# Altium schematic sheet SENSORS.SchDoc
size A4
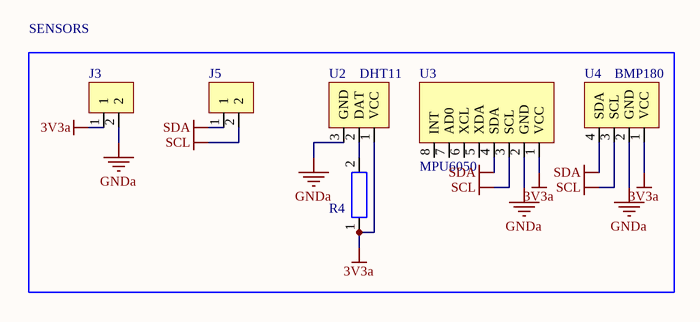
[diagram p0: SENSORS.SchDoc]

## Parts
J3  2x1_CONN  [CONN2x1_2.54mm]  (value not drawn)
J5  2x1_CONN  [CONN2x1_2.54mm]  (value not drawn)
R4  330R  [THT RESISTOR]  (value not drawn)
U2  DHT11  [DHT11]
U3  MPU6050  [MPU6050]
U4  BMP180  [BMP180]

## Blocks framed on the sheet
SENSORS: J3 J5 R4 U2-U4

## Nets
3V3a: J3.1 R4.1 U2.1(VCC) U3.1(VCC) U4.1(VCC)
GNDa: J3.2 U2.3(GND) U3.2(GND) U4.2(GND)
SCL: J5.2 U3.3(SCL) U4.3(SCL)
SDA: J5.1 U3.4(SDA) U4.4(SDA)
NetR4_2: R4.2 U2.2(DAT)

Not connected (* = marked no-connect by the designer): U3 5(XDA) 6(XCL) 7(AD0) 8(INT)

## Library data of the parts
J3 J5 = CONN 2x1: THT 2x1 2.54mm CONN
R4 = Resistor: Through-hole resistor
U2 = DHT11: Humidity and temperature sensor
U3 = MPU6050: 6DOF IMU sensor
U4 = BMP180: Bosch Pressure Sensor